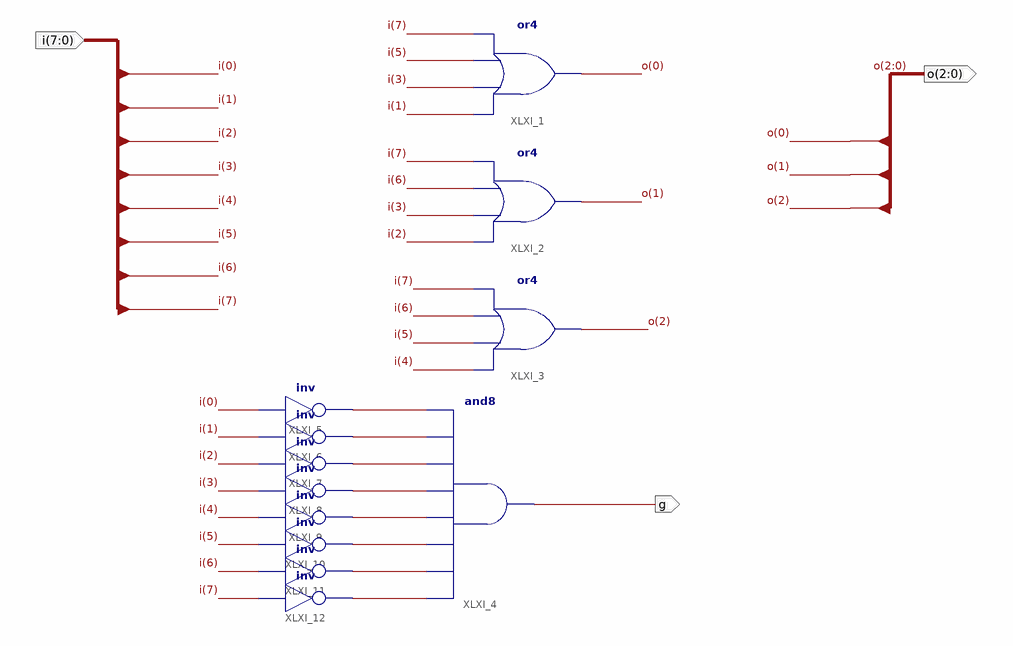
[diagram p0: schematic sheet 1]
// Xilinx ISE schematic encoder8_3.sch (aspartan6) as structural Verilog: 12 symbols, 3 ports
module encoder8_3 (
  input  [7:0] i,
  output [2:0] o,
  output g
);

  wire XLXN_1, XLXN_2, XLXN_3, XLXN_4, XLXN_5, XLXN_6, XLXN_7, XLXN_8;

  or XLXI_1 (o[0], i[1], i[3], i[5], i[7]);
  or XLXI_2 (o[1], i[2], i[3], i[6], i[7]);
  or XLXI_3 (o[2], i[4], i[5], i[6], i[7]);
  and XLXI_4 (g, XLXN_8, XLXN_7, XLXN_6, XLXN_5, XLXN_4, XLXN_3, XLXN_2, XLXN_1);
  not XLXI_5 (XLXN_1, i[0]);
  not XLXI_6 (XLXN_2, i[1]);
  not XLXI_7 (XLXN_3, i[2]);
  not XLXI_8 (XLXN_4, i[3]);
  not XLXI_9 (XLXN_5, i[4]);
  not XLXI_10 (XLXN_6, i[5]);
  not XLXI_11 (XLXN_7, i[6]);
  not XLXI_12 (XLXN_8, i[7]);
endmodule
